# EAGLE design 0127_microphone_type_J (EAGLE 9.2.2)

## Sheet 1 of 2
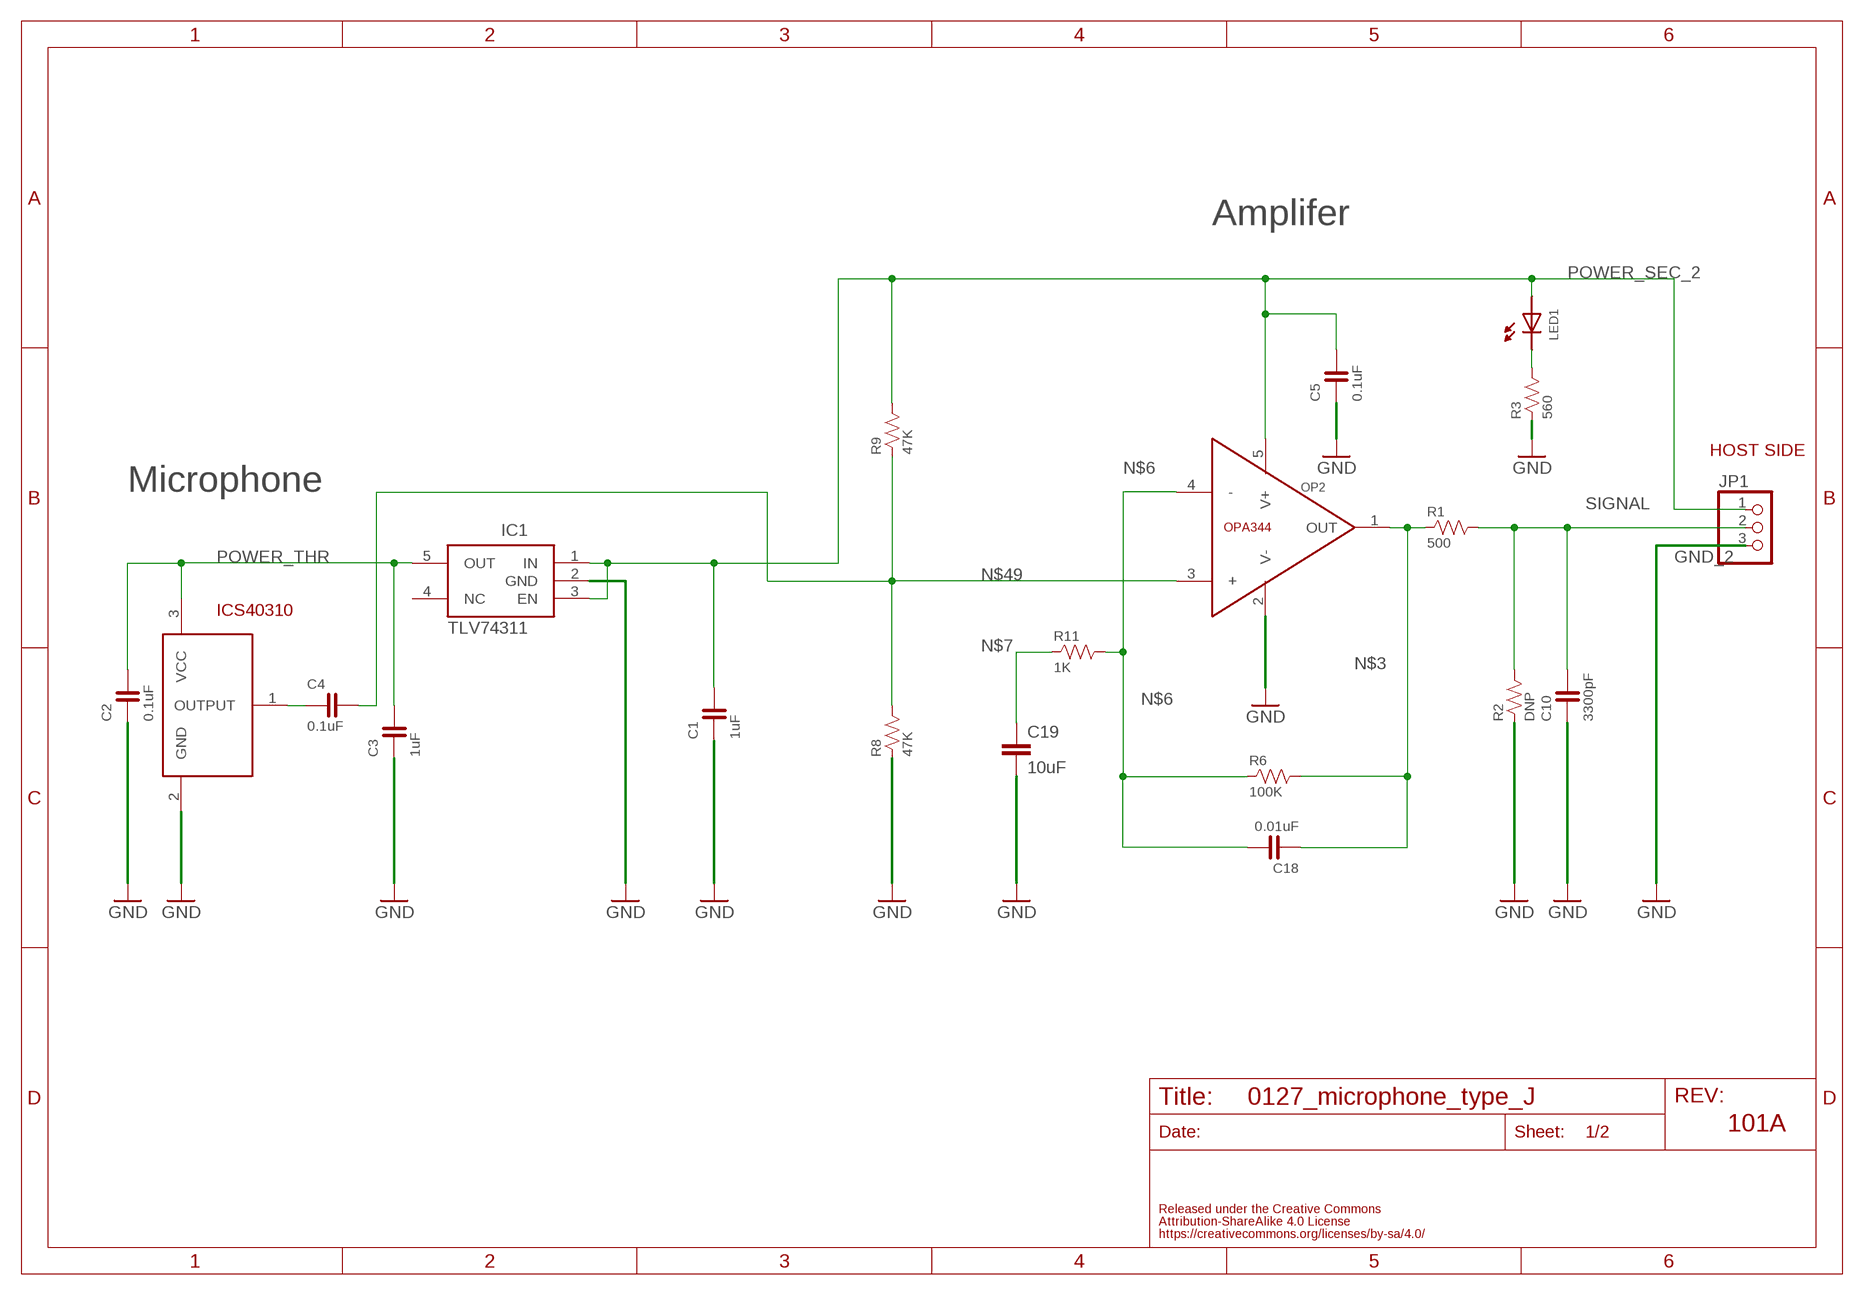
[diagram p0: schematic, sheet 1]

### Parts
C1  1uF  CAPACITOR-0603  [0603]
C2  0.1uF  CAPACITOR-0603  [0603]
C3  1uF  CAPACITOR-0603  [0603]
C4  0.1uF  CAPACITOR-0603  [0603]
C5  0.1uF  CAPACITOR-0603  [0603]
C10  3300pF  CAPACITOR-0603  [0603]
C18  0.01uF  CAPACITOR-0603  [0603]
C19  10uF  C-EUC1206K  [C1206K]
IC1  TLV74311  [SOT-23-5]
ICS40310  ANALOG-MICICS40310  [ICS40310]
JP1  PINHD-1X3  [1X03]
LED1  LED-0603-NARROW  [0603-NARROW]
OP2  OPA344  [SOT23-5]
R1  500  RESISTOR-0603  [0603]
R2  DNP  RESISTOR-0603  [0603]
R3  560  RESISTOR-0603  [0603]
R6  100K  RESISTOR-0603  [0603]
R8  47K  RESISTOR-0603  [0603]
R9  47K  RESISTOR-0603  [0603]
R11  1K  RESISTOR-0603  [0603]

### Nets
GND_2: C1.1 C2.1 C3.1 C5.1 C10.1 C19.2 IC1.2(GND) ICS40310.2(GND) JP1.3 OP2.2(V-) R2.1 R3.1 R8.1 ; supply symbol labelled GND
N$3: C18.1 OP2.1(OUT) R1.1 R6.2
N$4: C4.1 ICS40310.1(OUTPUT)
N$5: LED1.CATHODE R3.2
N$6: C18.2 OP2.4(-) R6.1 R11.2
N$7: C19.1 R11.1
N$49: C4.2 OP2.3(+) R8.2 R9.1
POWER_SEC_2: C1.2 C5.2 IC1.1(IN) IC1.3(EN) JP1.1 LED1.ANODE OP2.5(V+) R9.2
POWER_THR: C2.2 C3.2 IC1.5(OUT) ICS40310.3(VCC)
SIGNAL: C10.2 JP1.2 R1.2 R2.2
Unconnected: IC1.4(NC)

### Notes on the sheet
- Amplifer
- HOST SIDE
- Microphone
- ICS40310
- 101A

## Sheet 2 of 2
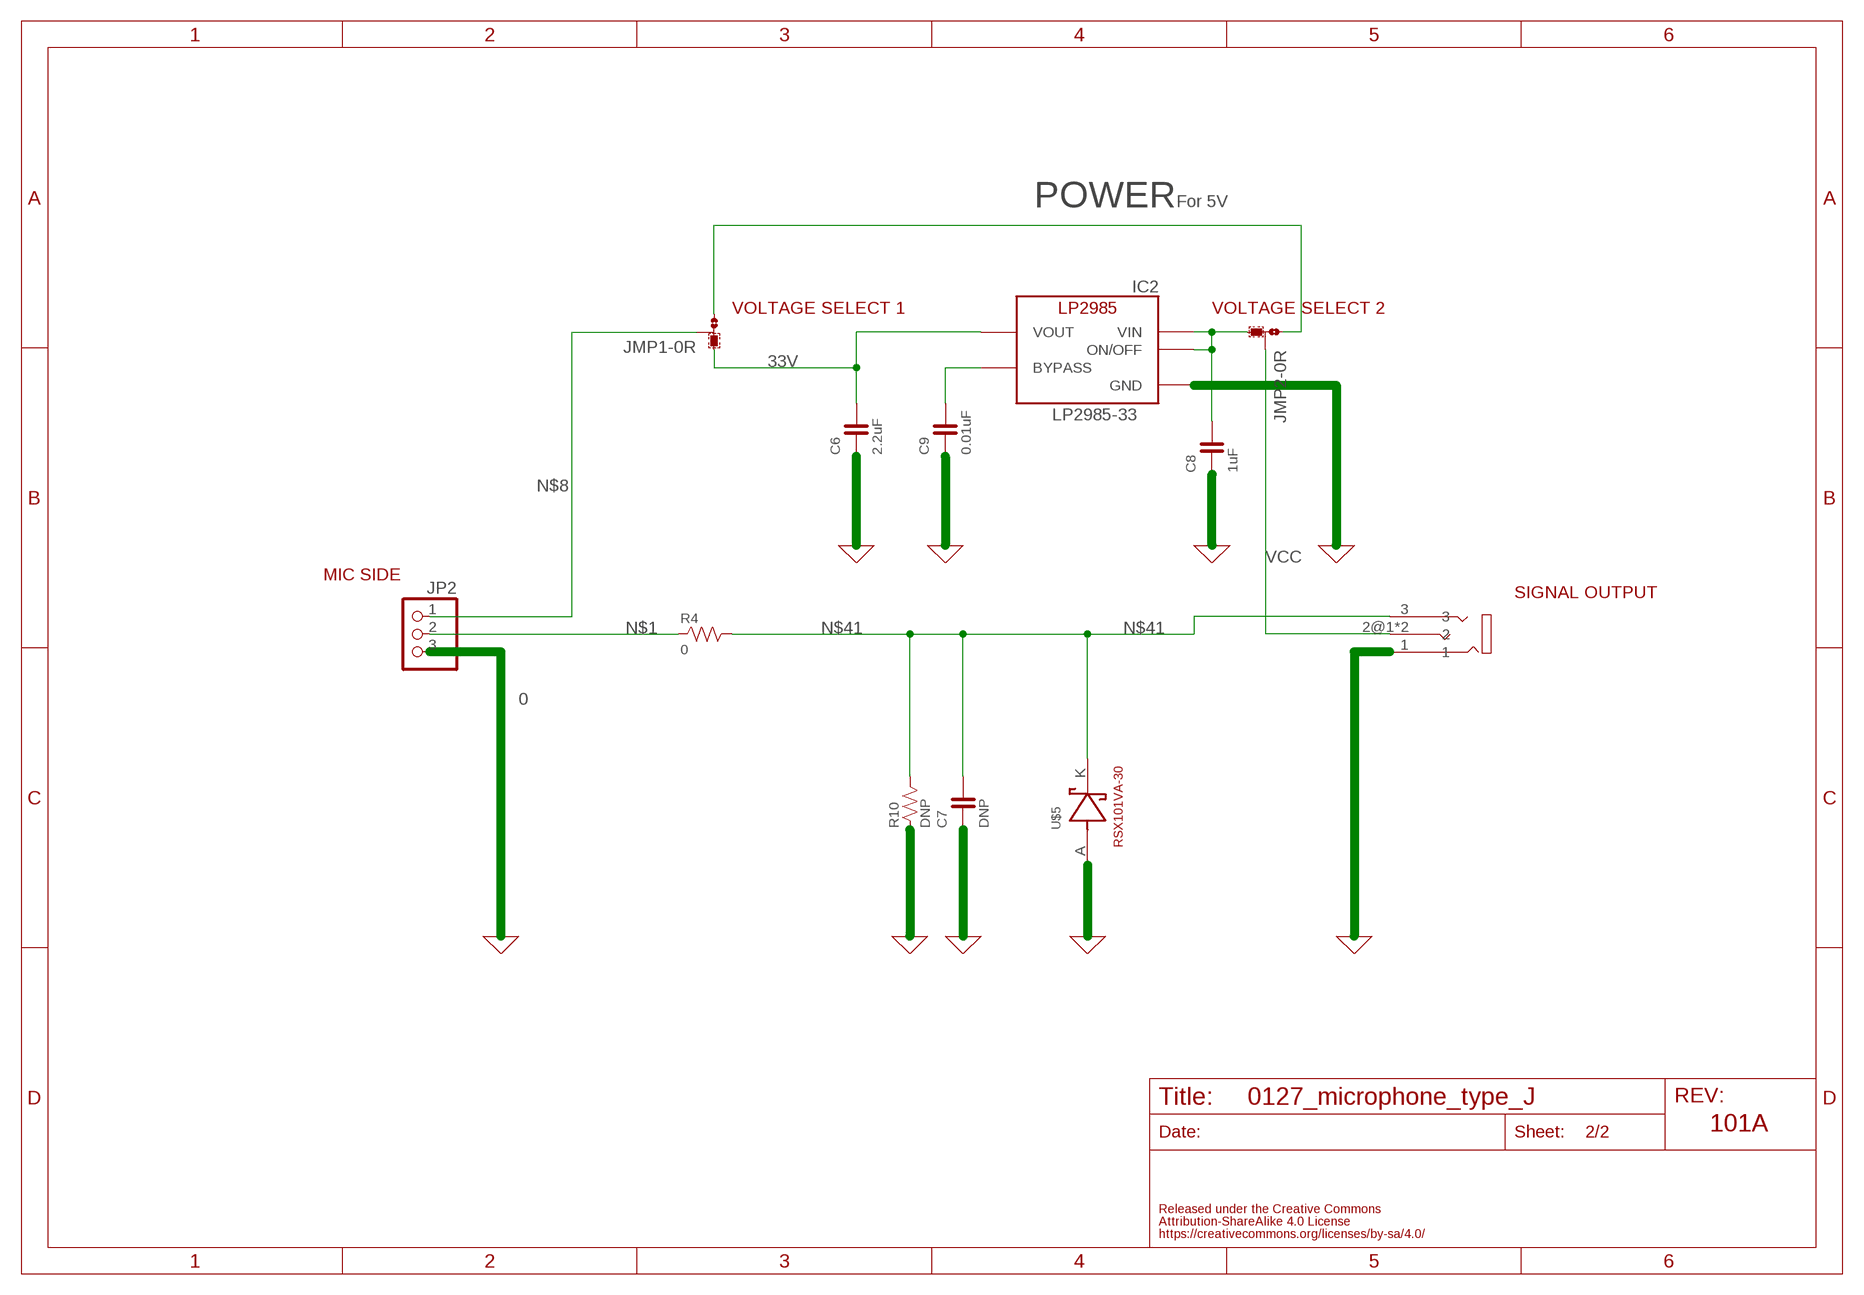
[diagram p1: schematic, sheet 2]

### Parts
C6  2.2uF  CAPACITOR-0603  [0603]
C7  DNP  CAPACITOR-0603  [0603]
C8  1uF  CAPACITOR-0603  [0603]
C9  0.01uF  CAPACITOR-0603  [0603]
IC2  LP2985-33  LP2985-33DBV  [SOT-23-5]
JMP1  0R-JUMPA  [A0R-JMP]
JMP2  0R-JUMPA  [A0R-JMP]
JP2  PINHD-1X3  [1X03]
R4  0  RESISTOR-0603  [0603]
R10  DNP  RESISTOR-0603  [0603]
U$4  MJ8435  [MJ8435]
U$5  RSX101VA-30  [RSX101VA-30]

### Nets
0: C6.1 C7.1 C8.1 C9.1 IC2.2(GND) JP2.3 R10.1 U$4.1 U$5.A(ANODE) ; supply symbol labelled GND
33V: C6.2 IC2.5(VOUT) JMP1.1
N$1: JP2.2 R4.1
N$2: JMP1.3 JMP2.1
N$8: JMP1.2 JP2.1
N$41: C7.2 R4.2 R10.2 U$4.3 U$5.K(CATHODE)
N$42: C9.2 IC2.4(BYPASS)
N$47: C8.2 IC2.1(VIN) IC2.3(ON/OFF) JMP2.3
VCC: JMP2.2 U$4.2@1 U$4.2@2

### Notes on the sheet
- POWER | For 5V
- VOLTAGE SELECT 1 | VOLTAGE SELECT 2
- LP2985-33
- MIC SIDE
- SIGNAL OUTPUT
- 101A

## Library data of the parts
C1-C6 C8 C9 C18 = FaBo-Capacitor:CAPACITOR: CAPACITOR
C7 C10 = FaBo-Capacitor:CAPACITOR: CAPACITOR; SPICEPREFIX: C
C19 = rcl:C-EU: CAPACITOR, European symbol; SPICEPREFIX: C
IC1 = FaBo-Supply:TLV74311
IC2 = FaBo-Supply:LP2985: LP2985
ICS40310 = FaBo-Sound:ANALOG-MIC
JMP1 JMP2 = jump-0r-smd:0R-JUMP: SMD 0R 0805 Jumper
JP1 JP2 = pinhead:PINHD-1X3: PIN HEADER
LED1 = FaBo-LED:LED
OP2 = FaBo-Opamp:OPA344
R1-R4 R6 R8-R11 = FaBo-Resistors:RESISTOR: RESISTOR
U$4 = FaBo-Sound:MJ8435
U$5 = FaBo-Diode:RSX101VA-30

## Board
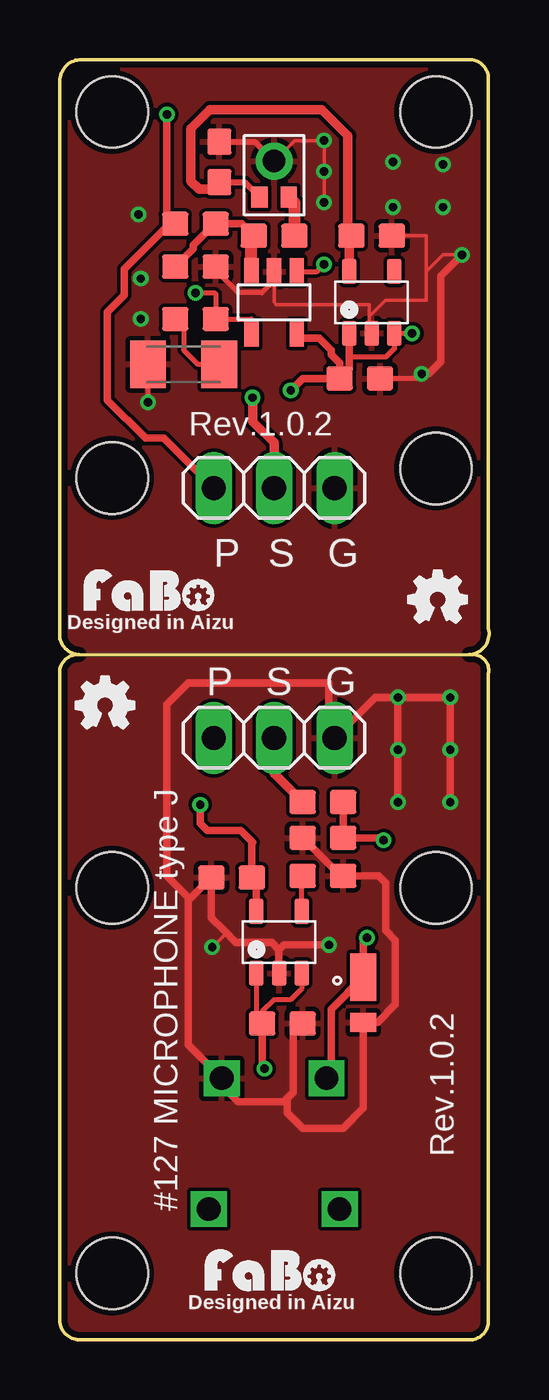
[diagram p2: board, top side]
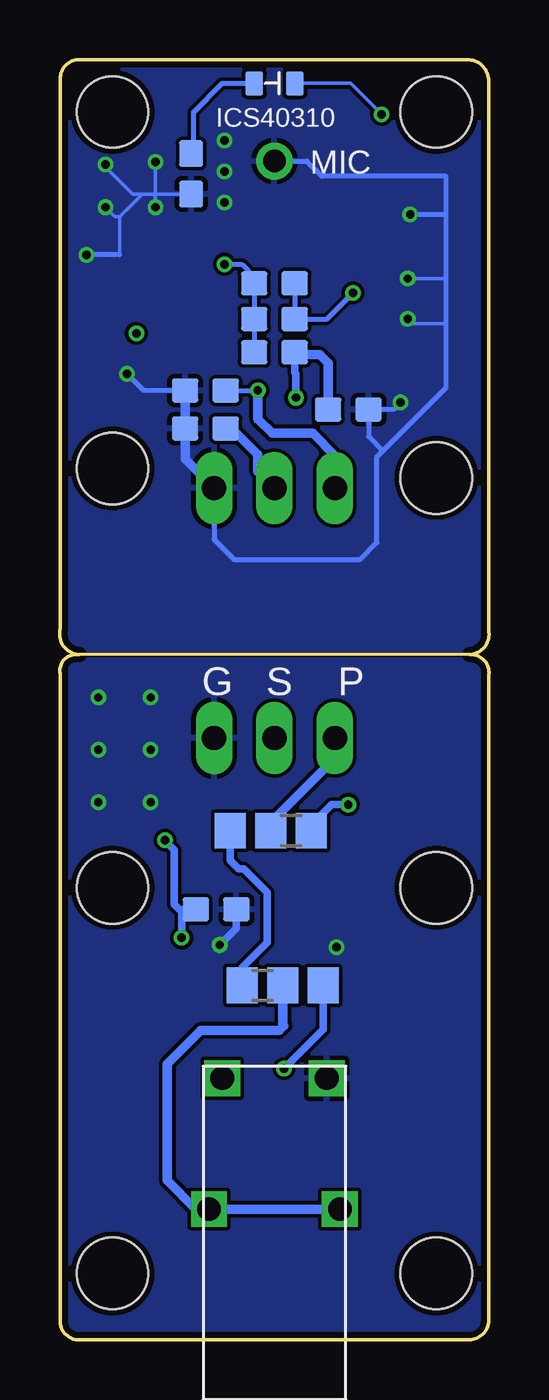
[diagram p3: board, bottom side, seen from below]

Size 18.04 x 53.81 mm. Coordinates in mm from the lower left corner, seen from the top.
Outline: 0.01,0.9 0.01,27.9 arc-104 0.81,28.8 arc-96 0.01,29.8 0.01,52.9 arc-90 0.91,53.8 17.11,53.8 arc-97 18.01,53 18.01,29.9 arc-102 17.21,28.8 17.31,28.8 arc-105 18.01,28 18.01,0.9 arc-97 17.21,0 0.91,0 arc-97 0.01,0.9
Copper layers (1*16): Top 0.035mm / dielectric 1.6mm / Bottom 0.035mm
Design rules "PCBway": minimum track width 6mil, minimum drill 12mil, track to track 6mil, track to pad 6mil, pad to pad 6mil, via to via 6mil, smd to smd 6mil, copper to edge 10mil, drill to drill 10mil, minimum pad ring 10mil, minimum via ring 6mil, stop-mask expansion 2mil, vias tented up to drill 100mil, thermal gap 8mil
Holes 3 mm at 2.21,51.6 15.81,51.6 15.81,36.62 2.21,36.22 2.21,19 15.81,19 2.21,2.8 15.81,2.8
Milling: 1 lines

### Footprints (pad centres in the part's own frame; a part is rotated, then mirrored left to right if it is on the bottom)
0603 = smd 1.1 x 1: 1 -0.85,0; 2 0.85,0
C1206K = smd 1.5 x 2: 1 -1.5,0; 2 1.5,0
SOT-23-5 = smd 0.6 x 1.05: 1 -0.95,-1.3; 2 0,-1.3; 3 0.95,-1.3; 4 0.95,1.3; 5 -0.95,1.3
ICS40310 = smd 0.68 x 0.9: 1 -0.61,0.92; 3 0.61,0.92 | drill 0.95 pad 1.55: 2 0,-0.6
A0R-JMP = smd 1.5 x 1.3: 1 0,1.7; 2 0,0; 3 0,-1.7
1X03 = drill 1.016 long: 1 -2.54,0; 2 0,0; 3 2.54,0
0603-NARROW = smd 0.75 x 1: ANODE -0.85,0; CATHODE 0.85,0
SOT23-5 = smd 0.6 x 1.1: 1 -0.95,-1.3; 2 0,-1.3; 3 0.95,-1.3; 4 0.95,1.3; 5 -0.95,1.3
MJ8435 = drill 1 square: 1 -2.2,-6.5; 2@1 2.75,-1; 2@2 -2.75,-1; 3 2.2,-6.5
RSX101VA-30 = smd 1.1 x 0.8: A 0,-1.25 | smd 1.1 x 2: K 0,0.65

### Placement (x,y rotation side)
C1  12.61,40.4 180 top
C2  6.71,49.5 270 top
C3  13.11,46.4 180 top
C4  9.01,46.4 180 top
C5  11.91,39.9 0 bottom
C6  7.23,19.43 0 top
C7  11.46,18.1 180 bottom
C8  9.36,13.3 180 top
C9  11.06,19.5 180 top
C10  5.91,39.1 180 bottom
C18  9.01,42.9 0 bottom
C19  5.21,41 180 top
IC1  13.11,43.6 0 top
IC2  9.22,16.71 0 top
ICS40310  9.01,48.94 180 top
JMP1  9.16,21.4 270 bottom
JMP2  8.66,14.9 90 bottom
JP1  9.01,35.8 0 top
JP2  9.01,25.3 0 top
LED1  9.01,52.8 180 bottom
LOGO1  [LOGO_FABO_S]  3.82,30.48 0 top
LOGO2  [LOGO_FABO_S]  8.9,1.91 0 top
OP2  9.01,43.6 180 top
R1  9.01,41.5 0 bottom
R2  11.91,38.3 0 bottom
R3  12.51,49 90 bottom
R4  11.06,22.6 0 top
R6  9.01,44.4 180 bottom
R8  5.71,45.1 180 top
R9  5.71,46.9 180 top
R10  11.06,21.1 0 top
R11  5.71,42.9 0 top
U$2  LOGO_OSHW-S  [LOGO_OSHW_S]  15.89,31.12 0 top
U$4  9.01,4.5 180 bottom
U$5  12.76,14.6 0 top
U$6  LOGO_OSHW-S  [LOGO_OSHW_S]  1.92,26.67 0 top

### Tracks (layer width: path | path; a pad name or v marks a point on that pad's centre or on a via)
0  (via drill 0.35)
  Top 0.152: v6.41,16.5 6.91,17 6.91,17.2
  Top 0.305: C8.1 9.81,12.9 9.81,10.4 9.56,10.15 | 9.56,10.15 9.41,10 7.51,10 6.81,10.7 U$4.1 5.41,12.4 5.41,18.47 5.48,18.53 | 9.21,16.4 8.91,16.7 7.41,16.7 6.91,17.2 6.38,17.74 C6.1 5.48,18.53 | IC2.2 9.21,16.4 | R10.1 11.81,19.5 C9.1 13.41,19.5 13.71,19.2 13.71,17.2 14.11,16.8 14.11,14.1 13.36,13.35 U$5.A 12.76,9.75 11.91,8.9 10.21,8.9 9.56,9.55 9.56,10.15 | 5.48,18.53 4.51,19.5 4.51,26.7 5.41,27.6 11.31,27.6 11.31,25.54 JP2.3 13.25,27 v14.21,27 | 9.21,16.4 9.41,16.6 v11.31,16.6 | v14.21,27 v16.41,27 v16.41,24.8 v16.41,22.6 | v14.21,27 v14.21,24.8 v14.21,22.6
  Bottom 0.305: v11.31,16.6 10.61,17.3 C7.1
  pour Top: 0.01,0 18.11,0 18.11,28.6 0.01,28.6
  pour Bottom: 0.01,0 18.11,0 18.11,28.6 0.01,28.6
33V  (via drill 0.35)
  Top 0.305: v5.91,22.5 5.91,21.7 6.21,21.4 7.61,21.4 8.11,20.9 8.08,20.87 C6.2 8.27,19.24 IC2.5
  Bottom 0.305: JMP1.1 7.46,21.65 6.61,22.5 v5.91,22.5
GND_2  (via drill 0.35)
  Top 0.152: IC1.2 13.01,42.4 13.01,43 | 13.01,43 13.01,43.5 9.11,43.5 9.01,43.6 OP2.2 | 15.41,44.9 15.41,43.7 13.71,43.7 13.01,43 | 15.41,44.9 15.41,46.4 C3.1 | v16.91,45.6 16.11,45.6 15.41,44.9 | ICS40310.2 9.87,50.4 v11.11,50.4 v11.11,49.1 v11.11,47.8
  Top 0.2: R8.1 6.56,44.95 7.51,44 8.51,44 9.01,44.5 OP2.2 | C19.2 v3.71,39.4 | v15.21,40.6 15.01,40.4 C1.1
  Top 0.254: C2.1 8.2,50.35 ICS40310.2
  Top 0.305: v15.21,40.6 15.51,40.6 16.01,41.1 16.01,44.7 v16.91,45.6
  Bottom 0.152: R3.1 14.01,48.15 | 14.01,48.15 14.11,48.15 | 14.11,48.15 14.56,48.15 | 14.56,48.15 14.96,48.15 16.11,49.3 v16.11,49.4 | 15.51,47.2 15.51,45.6 | 14.56,48.15 15.51,47.2 | v14.01,47.6 14.01,48.05 14.11,48.15 | v14.01,49.5 14.01,48.15 | v16.11,47.6 15.71,47.2 15.51,47.2 | v3.41,44.6 1.81,44.6 | v3.41,42.9 3.21,42.7 1.81,42.7
  Bottom 0.2: 1.81,47.3 1.81,48.9 7.01,48.9 7.65,49.54 ICS40310.2 | 1.81,47.3 1.81,44.6 1.81,42.7 1.81,40 4.46,37.35 | 15.51,45.6 v16.91,45.6 | 4.46,37.35 4.71,37.1 4.71,33.5 5.41,32.8 10.71,32.8 11.55,33.64 JP1.3 | 4.46,37.35 5.06,37.95 C10.1 4.01,39.1 v3.71,39.4 | C5.1 14.51,39.9 v15.21,40.6 | v3.31,47.3 1.81,47.3
  Bottom 0.406: JP1.3 12.76,37.01 R2.1 C5.1
  pour Bottom: 0.01,29 18.01,29 18.01,53.8 0.01,53.8
  pour Top: 0.01,29 18.01,29 18.01,53.8 0.01,53.8
N$1
  Top 0.406: R4.1 9.01,23.8 JP2.2
N$2
  Bottom 0.305: JMP2.1 10.36,15.65 9.31,16.7 9.31,18.8 10.31,19.8 10.51,19.8 10.86,20.15 JMP1.3
N$3  (via drill 0.35)
  Top 0.2: OP2.1 10.81,44.9 v11.11,45.2
  Bottom 0.152: 9.86,44.67 R6.2
  Bottom 0.2: v11.11,45.2 10.4,45.2 9.86,44.67 | R6.2 C18.1 R1.1
N$4
  Top 0.508: ICS40310.1 9.86,47.78 C4.1
N$5
  Bottom 0.2: R3.2 12.41,49.95 12.41,51.6 11.21,52.8 LED1.CATHODE
N$6  (via drill 0.35)
  Top 0.2: OP2.4 8.06,42.9 R11.2 6.56,43.95 6.51,44 v5.71,44
  Bottom 0.2: R6.1 C18.2 6.81,42.9 v5.71,44
N$7
  Top 0.2: R11.1 5.21,42.55 5.21,41.6 5.81,41 C19.1
N$8
  Bottom 0.305: JMP1.2 9.16,21.75
  Bottom 0.406: JP2.1 6.47,24.44 9.16,21.75
N$41  (via drill 0.35)
  Top 0.305: v13.61,21 13.51,21.1 R10.2 R4.2 | v12.91,16.9 12.76,16.75 U$5.K 11.41,13.9 11.41,11.2 U$4.3
  Bottom 0.305: 12.71,18.1 13.01,18.1 13.21,18.3 13.21,20.6 v13.61,21 | 12.71,18.1 C7.2 | v12.91,16.9 12.91,17.9 12.71,18.1
N$42
  Top 0.2: IC2.4 10.17,19.46 C9.2
N$47  (via drill 0.35)
  Top 0.2: IC2.1 8.27,13.54 C8.2 8.51,13.8 9.01,14.3 9.71,14.3 10.17,14.76 IC2.3
  Top 0.305: C8.2 8.51,11.5 v8.61,11.4
  Bottom 0.305: v8.61,11.4 6.96,13.05 JMP2.3
N$49
  Top 0.254: 8.06,46.3 C4.2
  Top 0.305: C4.2 7.66,46.9 R9.1 6.51,46.9 5.61,46 5.61,45.85 R8.2
  Top 0.508: OP2.3 8.06,46.3
POWER_SEC_2  (via drill 0.35)
  Top 0.2: v14.81,42.3 IC1.3 14.06,41.65 13.71,41.3 12.16,41.3
  Top 0.305: v9.71,39.9 10.21,40.4 C1.2 | C1.2 12.16,40.8 12.16,41.3 IC1.1 | OP2.5 10.16,42.1 10.91,42.1 11.41,41.6 11.41,41.4 11.76,41.05 C1.2 | v4.51,51.5 4.51,47.25 4.69,47.08 | 4.69,47.08 R9.2 | JP1.1 4.37,37.9 3.61,37.9 2.01,39.5 2.01,43.2 2.71,43.9 2.71,45 4.69,46.98 4.69,47.08
  Bottom 0.152: LED1.ANODE 5.81,52.8 v4.51,51.5
  Bottom 0.2: C5.2 v9.71,39.9
  Bottom 0.406: JP1.1 6.47,37.16 7.41,38.1 9.11,38.1 9.71,38.7 v9.71,39.9
POWER_THR
  Top 0.254: C2.2 7.77,48.65 ICS40310.3
  Top 0.406: IC1.5 12.16,46.3 C3.2 12.11,46.55 12.11,50.6 11.01,51.7 6.31,51.7 5.51,50.9 5.51,48.7 5.86,48.35 6.41,48.35 C2.2
SIGNAL  (via drill 0.35)
  Top 0.406: v8.11,39.6 8.11,38.6 9.01,37.7 JP1.2
  Bottom 0.305: R1.2 8.16,40.65 8.11,40.6 v8.11,39.6
  Bottom 0.406: JP1.2 9.71,36.5 9.71,37.2 10.81,38.3 R2.2 | C10.2 6.76,41.05 7.11,41.4 8.06,41.4 R1.2
VCC
  Bottom 0.305: 11.71,5.5 U$4.2@1
  Bottom 0.406: JMP2.2 8.66,13.25 8.61,13.2 8.81,13 12.11,13 13.51,11.6 13.51,6.7 12.31,5.5 11.71,5.5 U$4.2@2

### Text on the board
tPlace: Rev.1.0.2 | P | S | G | Designed in Aizu | P | S | G | Rev.1.0.2 | #127 MICROPHONE type J | Designed in Aizu
bPlace: MIC | P | S | G